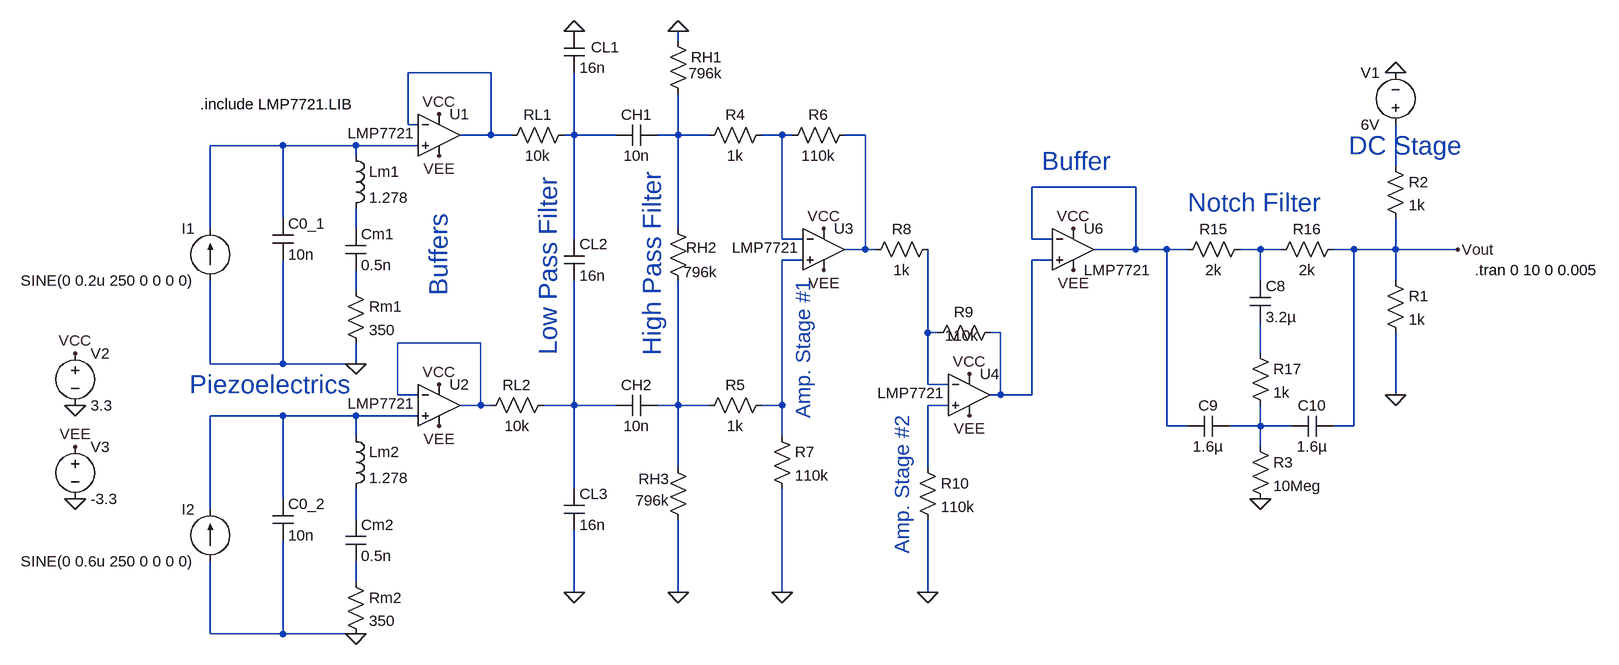
[diagram p0: schematic Final Draft.asc]
Final Draft.asc, the LTspice schematic file:
Version 4.1
SHEET 1 1916 852
WIRE 128 -80 128 -96
WIRE -160 -32 -288 -32
WIRE -288 48 -288 -32
WIRE -272 48 -288 48
WIRE -160 64 -160 -32
WIRE -160 64 -208 64
WIRE -128 64 -160 64
WIRE -32 64 -32 -32
WIRE -32 64 -48 64
WIRE 32 64 -32 64
WIRE 128 64 128 0
WIRE 128 64 96 64
WIRE 176 64 128 64
WIRE 288 64 256 64
WIRE 304 64 288 64
WIRE 416 64 384 64
WIRE -480 80 -592 80
WIRE -368 80 -480 80
WIRE -272 80 -368 80
WIRE -368 96 -368 80
WIRE 1232 112 1232 48
WIRE 832 144 672 144
WIRE -480 192 -480 80
WIRE -592 208 -592 80
WIRE -368 208 -368 176
WIRE 128 208 128 64
WIRE -32 224 -32 64
WIRE 288 224 288 64
WIRE 320 224 288 224
WIRE 672 224 672 144
WIRE 704 224 672 224
WIRE 416 240 416 64
WIRE 416 240 384 240
WIRE 432 240 416 240
WIRE 832 240 832 144
WIRE 832 240 768 240
WIRE 880 240 832 240
WIRE 912 240 880 240
WIRE 1024 240 992 240
WIRE 1056 240 1024 240
WIRE 1168 240 1136 240
WIRE 1232 240 1232 192
WIRE 1232 240 1168 240
WIRE 1328 240 1232 240
WIRE 320 256 288 256
WIRE 704 256 672 256
WIRE 1024 288 1024 240
WIRE 1232 288 1232 240
WIRE -368 304 -368 272
WIRE 512 368 512 240
WIRE 528 368 512 368
WIRE 624 368 608 368
WIRE -176 384 -304 384
WIRE 1024 400 1024 352
WIRE -592 416 -592 288
WIRE -480 416 -480 256
WIRE -480 416 -592 416
WIRE -368 416 -368 384
WIRE -368 416 -480 416
WIRE 512 448 512 368
WIRE 544 448 512 448
WIRE -304 464 -304 384
WIRE -272 464 -304 464
WIRE 624 464 624 368
WIRE 624 464 608 464
WIRE 672 464 672 256
WIRE 672 464 624 464
WIRE 1232 464 1232 368
WIRE -176 480 -176 384
WIRE -176 480 -208 480
WIRE -160 480 -176 480
WIRE -32 480 -32 288
WIRE -32 480 -80 480
WIRE 32 480 -32 480
WIRE 128 480 128 288
WIRE 128 480 96 480
WIRE 176 480 128 480
WIRE 288 480 288 256
WIRE 288 480 256 480
WIRE 544 480 512 480
WIRE -480 496 -592 496
WIRE -368 496 -480 496
WIRE -272 496 -368 496
WIRE 880 512 880 240
WIRE 912 512 880 512
WIRE 1024 512 1024 480
WIRE 1024 512 976 512
WIRE 1072 512 1024 512
WIRE 1168 512 1168 240
WIRE 1168 512 1136 512
WIRE -368 528 -368 496
WIRE 288 528 288 480
WIRE 1024 544 1024 512
WIRE 128 576 128 480
WIRE 512 576 512 480
WIRE -32 608 -32 480
WIRE -480 624 -480 496
WIRE -592 640 -592 496
WIRE -368 656 -368 608
WIRE -368 752 -368 720
WIRE -32 768 -32 672
WIRE 128 768 128 656
WIRE 288 768 288 608
WIRE 512 768 512 656
WIRE -592 832 -592 720
WIRE -480 832 -480 688
WIRE -480 832 -592 832
WIRE -368 832 -480 832
FLAG -368 416 0
FLAG -800 480 0
FLAG -800 624 0
FLAG -800 400 VCC
FLAG -240 32 VCC
FLAG -800 544 VEE
FLAG -240 96 VEE
FLAG -368 832 0
FLAG -240 448 VCC
FLAG -240 512 VEE
FLAG -32 -96 0
FLAG -32 768 0
FLAG 128 768 0
FLAG 1328 240 Vout
FLAG 128 -96 0
FLAG 736 208 VCC
FLAG 736 272 VEE
FLAG 1232 464 0
FLAG 1024 624 0
FLAG 288 768 0
FLAG 512 768 0
FLAG 352 208 VCC
FLAG 576 432 VCC
FLAG 352 272 VEE
FLAG 576 496 VEE
FLAG 1232 -32 0
SYMBOL OpAmps\\opamp2 -240 0 R0
WINDOW 3 -141 61 Left 2
SYMATTR Value LMP7721
SYMATTR InstName U1
SYMBOL ind -384 80 R0
SYMATTR InstName Lm1
SYMATTR Value 1.278
SYMBOL cap -384 208 R0
SYMATTR InstName Cm1
SYMATTR Value 0.5n
SYMBOL res -384 288 R0
SYMATTR InstName Rm1
SYMATTR Value 350
SYMBOL voltage -800 384 R0
WINDOW 123 0 0 Left 0
WINDOW 39 0 0 Left 0
SYMATTR InstName V2
SYMATTR Value 3.3
SYMBOL voltage -800 528 R0
WINDOW 123 0 0 Left 0
WINDOW 39 0 0 Left 0
SYMATTR InstName V3
SYMATTR Value -3.3
SYMBOL res -32 48 R90
WINDOW 0 0 56 VBottom 2
WINDOW 3 32 56 VTop 2
SYMATTR InstName RL1
SYMATTR Value 10k
SYMBOL ind -384 512 R0
SYMATTR InstName Lm2
SYMATTR Value 1.278
SYMBOL cap -384 656 R0
SYMATTR InstName Cm2
SYMATTR Value 0.5n
SYMBOL res -384 736 R0
SYMATTR InstName Rm2
SYMATTR Value 350
SYMBOL OpAmps\\opamp2 -240 416 R0
WINDOW 3 -141 61 Left 2
SYMATTR Value LMP7721
SYMATTR InstName U2
SYMBOL res -64 464 R90
WINDOW 0 0 56 VBottom 2
WINDOW 3 32 56 VTop 2
SYMATTR InstName RL2
SYMATTR Value 10k
SYMBOL cap -48 608 R0
SYMATTR InstName CL3
SYMATTR Value 16n
SYMBOL cap -48 224 R0
SYMATTR InstName CL2
SYMATTR Value 16n
SYMBOL cap -48 -96 R0
WINDOW 0 42 25 Left 2
SYMATTR InstName CL1
SYMATTR Value 16n
SYMBOL cap 96 48 R90
WINDOW 0 0 32 VBottom 2
WINDOW 3 32 32 VTop 2
SYMATTR InstName CH1
SYMATTR Value 10n
SYMBOL cap 96 464 R90
WINDOW 0 0 32 VBottom 2
WINDOW 3 32 32 VTop 2
SYMATTR InstName CH2
SYMATTR Value 10n
SYMBOL res 112 -96 R0
WINDOW 3 32 65 Left 2
SYMATTR Value 796k
SYMATTR InstName RH1
SYMBOL res 112 192 R0
WINDOW 0 28 45 Left 2
WINDOW 3 24 83 Left 2
SYMATTR InstName RH2
SYMATTR Value 796k
SYMBOL res 112 560 R0
WINDOW 3 -50 66 Left 2
WINDOW 0 -45 33 Left 2
SYMATTR Value 796k
SYMATTR InstName RH3
SYMBOL OpAmps\\opamp2 736 176 R0
SYMATTR InstName U6
SYMATTR Value LMP7721
SYMBOL res 1008 224 R90
WINDOW 0 0 56 VBottom 2
WINDOW 3 32 56 VTop 2
SYMATTR InstName R15
SYMATTR Value 2k
SYMBOL res 1152 224 R90
WINDOW 0 0 56 VBottom 2
WINDOW 3 32 56 VTop 2
SYMATTR InstName R16
SYMATTR Value 2k
SYMBOL cap 1008 288 R0
SYMATTR InstName C8
SYMATTR Value 3.2µ
SYMBOL cap 976 496 R90
WINDOW 0 0 32 VBottom 2
WINDOW 3 32 32 VTop 2
SYMATTR InstName C9
SYMATTR Value 1.6µ
SYMBOL res 1008 384 R0
SYMATTR InstName R17
SYMATTR Value 1k
SYMBOL cap 1136 496 R90
WINDOW 0 0 32 VBottom 2
WINDOW 3 32 32 VTop 2
SYMATTR InstName C10
SYMATTR Value 1.6µ
SYMBOL res 1216 272 R0
SYMATTR InstName R1
SYMATTR Value 1k
SYMBOL res 1216 96 R0
SYMATTR InstName R2
SYMATTR Value 1k
SYMBOL cap -496 192 R0
SYMATTR InstName C0_1
SYMATTR Value 10n
SYMBOL cap -496 624 R0
SYMATTR InstName C0_2
SYMATTR Value 10n
SYMBOL res 1008 528 R0
SYMATTR InstName R3
SYMATTR Value 10Meg
SYMBOL current -592 288 R180
WINDOW 0 24 80 Left 2
WINDOW 3 24 0 Left 2
WINDOW 123 0 0 Left 0
WINDOW 39 0 0 Left 0
SYMATTR InstName I1
SYMATTR Value SINE(0 0.2u 250 0 0 0 0)
SYMBOL current -592 720 R180
WINDOW 0 24 80 Left 2
WINDOW 3 24 0 Left 2
WINDOW 123 0 0 Left 0
WINDOW 39 0 0 Left 0
SYMATTR InstName I2
SYMATTR Value SINE(0 0.6u 250 0 0 0 0)
SYMBOL res 272 48 R90
WINDOW 0 0 56 VBottom 2
WINDOW 3 32 56 VTop 2
SYMATTR InstName R4
SYMATTR Value 1k
SYMBOL res 272 464 R90
WINDOW 0 0 56 VBottom 2
WINDOW 3 32 56 VTop 2
SYMATTR InstName R5
SYMATTR Value 1k
SYMBOL res 400 48 R90
WINDOW 0 0 56 VBottom 2
WINDOW 3 32 56 VTop 2
SYMATTR InstName R6
SYMATTR Value 110k
SYMBOL OpAmps\\opamp2 352 176 R0
WINDOW 3 -141 61 Left 2
SYMATTR Value LMP7721
SYMATTR InstName U3
SYMBOL res 272 512 R0
SYMATTR InstName R7
SYMATTR Value 110k
SYMBOL res 528 224 R90
WINDOW 0 0 56 VBottom 2
WINDOW 3 32 56 VTop 2
SYMATTR InstName R8
SYMATTR Value 1k
SYMBOL res 624 352 R90
WINDOW 0 0 56 VBottom 2
WINDOW 3 5 59 VTop 2
SYMATTR InstName R9
SYMATTR Value 110k
SYMBOL res 496 560 R0
SYMATTR InstName R10
SYMATTR Value 110k
SYMBOL OpAmps\\opamp2 576 400 R0
WINDOW 3 -141 61 Left 2
SYMATTR Value LMP7721
SYMATTR InstName U4
SYMBOL voltage 1232 64 R180
WINDOW 0 24 96 Left 2
WINDOW 3 24 16 Left 2
WINDOW 123 0 0 Left 0
WINDOW 39 0 0 Left 0
SYMATTR InstName V1
SYMATTR Value 6V
TEXT -608 16 Left 2 !.include LMP7721.LIB
TEXT 1544 272 Right 2 !.tran 0 10 0 0.005
TEXT -624 448 Left 4 ;Piezoelectrics
TEXT -240 184 VRight 4 ;Buffers
TEXT -72 128 VRight 4 ;Low Pass Filter
TEXT 88 120 VRight 4 ;High Pass Filter
TEXT 688 104 Left 4 ;Buffer
TEXT 912 168 Left 4 ;Notch Filter
TEXT 1160 80 Left 4 ;DC Stage
TEXT 320 288 VRight 3 ;Amp. Stage #1
TEXT 472 496 VRight 3 ;Amp. Stage #2

The netlist it stands for:
* Final Draft.asc
X§U1 N006 N001 VCC VEE N001 LMP7721  ; pins In+ In- V+ V- OUT
Lm1 N006 N009 1.278
Cm1 N009 N013 0.5n
Rm1 N013 0 350
V2 VCC 0 3.3
V3 VEE 0 -3.3
RL1 N002 N001 10k
Lm2 N020 N022 1.278
Cm2 N022 N023 0.5n
Rm2 N023 0 350
X§U2 N020 N015 VCC VEE N015 LMP7721  ; pins In+ In- V+ V- OUT
RL2 N017 N015 10k
CL3 N017 0 16n
CL2 N002 N017 16n
CL1 0 N002 16n
CH1 N003 N002 10n
CH2 N018 N017 10n
RH1 0 N003 796k
RH2 N003 N018 796k
RH3 N018 0 796k
X§U6 N012 N008 VCC VEE N008 LMP7721  ; pins In+ In- V+ V- OUT
R15 N010 N008 2k
R16 Vout N010 2k
C8 N010 N016 3.2µ
C9 N021 N008 1.6µ
R17 N016 N021 1k
C10 Vout N021 1.6µ
R1 Vout 0 1k
R2 N007 Vout 1k
C0_1 N006 0 10n
C0_2 N020 0 10n
R3 N021 0 10Meg
I1 0 N006 SINE(0 0.2u 250 0 0 0 0)
I2 0 N020 SINE(0 0.6u 250 0 0 0 0)
R4 N004 N003 1k
R5 N011 N018 1k
R6 N005 N004 110k
X§U3 N011 N004 VCC VEE N005 LMP7721  ; pins In+ In- V+ V- OUT
R7 N011 0 110k
R8 N014 N005 1k
R9 N012 N014 110k
R10 N019 0 110k
X§U4 N019 N014 VCC VEE N012 LMP7721  ; pins In+ In- V+ V- OUT
V1 N007 0 6V
.include LMP7721.LIB
.tran 0 10 0 0.005
* Piezoelectrics
* Buffers
* Low Pass Filter
* High Pass Filter
* Buffer
* Notch Filter
* DC Stage
* Amp. Stage #1
* Amp. Stage #2
.backanno
.end